# Altium schematic sheet BMS028B_Hardware.SchDoc: Hardware
size 431 x 279 mm; Date: Not shown in title block; ApprovedBy: Not shown in title block; CheckedBy: Not shown in title block; Author: Not shown in title block; CompanyName: Not shown in title block; DrawnBy: M Sunna; Engineer: Not shown in title block; Organization: Not shown in title block; Address1: Not shown in title block; Address2: Not shown in title block; Address3: Not shown in title block; Address4: Not shown in title block; DocumentNumber: 5; Revision: Use project parameter SCH_Rev; SheetNumber: 5; SheetTotal: 5; PageSetup: Record=PageOptions|CenterHorizontal=True|CenterVertical=True|PrintScale=1.00|XCorrection=1.00|YCorrection=1.00|PrintKind=0|BorderSize=5000000|LeftOffset=0|BottomOffset=0|Orientation=2|PaperLength=1000|PaperWidth=1000|Scale=100|PaperSource=15|PrintQuality=600|MediaType=1|DitherType=10|PaperKind=Letter|PrintScaleMode=1; CurrentTime: Not shown in title block; CurrentDate: Not shown in title block; Time: Not shown in title block; DocumentFullPathAndName: Not shown in title block; DocumentName: Not shown in title block; ModifiedDate: Not shown in title block; ImagePath: Not shown in title block
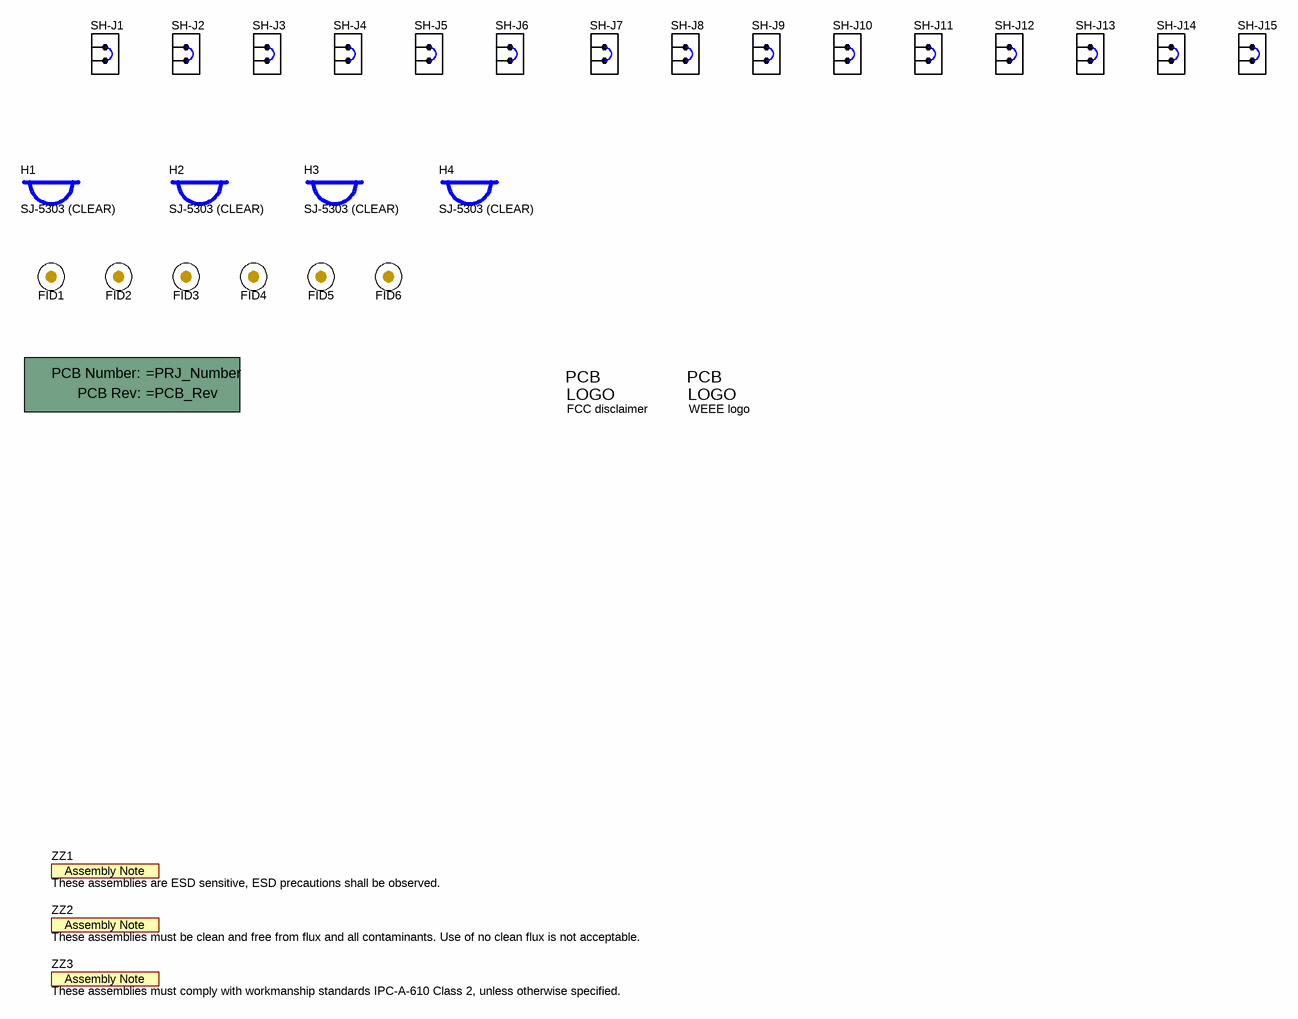
[diagram p0: BMS028B_Hardware.SchDoc]

## Parts
!PCB1  Printed Circuit Board  (value not drawn)  (mechanical)
FID1  Fiducial  [Fiducial10-20]  (value not drawn)
FID2  Fiducial  [Fiducial10-20]  (value not drawn)
FID3  Fiducial  [Fiducial10-20]  (value not drawn)
FID4  Fiducial  [Fiducial10-20]  (value not drawn)
FID5  Fiducial  [Fiducial10-20]  (value not drawn)
FID6  Fiducial  [Fiducial10-20]  (value not drawn)
H1  SJ-5303 (CLEAR)  [Bumpon_SJ5003Transparent]
H2  SJ-5303 (CLEAR)  [Bumpon_SJ5003Transparent]
H3  SJ-5303 (CLEAR)  [Bumpon_SJ5003Transparent]
H4  SJ-5303 (CLEAR)  [Bumpon_SJ5003Transparent]
Logo6  FCC disclaimer  [FCC_disclaimer]  (no BOM)
Logo7  WEEE logo  [WEEE_Minimum]  (no BOM)
SH-J1  SNT-100-BK-G  [SNT-100-BK-G]  (value not drawn)
SH-J2  SNT-100-BK-G  [SNT-100-BK-G]  (value not drawn)
SH-J3  SNT-100-BK-G  [SNT-100-BK-G]  (value not drawn)
SH-J4  SNT-100-BK-G  [SNT-100-BK-G]  (value not drawn)
SH-J5  SNT-100-BK-G  [SNT-100-BK-G]  (value not drawn)
SH-J6  SNT-100-BK-G  [SNT-100-BK-G]  (value not drawn)
SH-J7  SNT-100-BK-G  [SNT-100-BK-G]  (value not drawn)
SH-J8  SNT-100-BK-G  [SNT-100-BK-G]  (value not drawn)
SH-J9  SNT-100-BK-G  [SNT-100-BK-G]  (value not drawn)
SH-J10  SNT-100-BK-G  [SNT-100-BK-G]  (value not drawn)
SH-J11  SNT-100-BK-G  [SNT-100-BK-G]  (value not drawn)
SH-J12  SNT-100-BK-G  [SNT-100-BK-G]  (value not drawn)
SH-J13  SNT-100-BK-G  [SNT-100-BK-G]  (value not drawn)
SH-J14  SNT-100-BK-G  [SNT-100-BK-G]  (value not drawn)
SH-J15  SNT-100-BK-G  [SNT-100-BK-G]  (value not drawn)
ZZ1  These assemblies are ESD sensitive, ESD precautions shall be observed.  [AssemblyNote]  (no BOM)
ZZ2  These assemblies must be clean and free from flux and all contaminants. Use of no clean flux is not acceptable.  [AssemblyNote]  (no BOM)
ZZ3  These assemblies must comply with workmanship standards IPC-A-610 Class 2, unless otherwise specified.  [AssemblyNote]  (no BOM)

## Notes on the sheet
- (in symbol CMP-0003618-2) PCB Number:; PCB Rev:
- (in symbol CMP-0074769-1) PCB; LOGO
- (in symbol CMP-0074847-1) PCB; LOGO

## Library data of the parts
!PCB1 = CMP-0003618-2: Manufacturer: Any; CompType: PCB; PartNumber: =PRJ_Number; RoHS: O; MountType: N/A; Publisher: Texas Instruments; LatestRevisionDate: 2017-03-09; Key: PCB
FID1-FID6 = CMP-0077181-1: Fiducial mark.  There is nothing to buy or mount.; CompType: Fiducial; Manufacturer: N/A; MountType: N/A; PackageReference: N/A; PartNumber: N/A; ClassName: FiducialMark; Library Reference: Fiducial
H1-H4 = CMP-0003620-1: Bumpon, Hemisphere, 0.44 X 0.20, Clear; Manufacturer: 3M; CompType: Bumpon; PartNumber: SJ-5303 (CLEAR); RoHS: Y; PackageReference: Transparent Bumpon; MountType: N/A; ComponentLink1Description: Datasheet Link; ComponentLink1URL: http://multimedia.mmm.com/mws/mediawebserver.dyn?6666660Zjcf6lVs6EVs666cIsCOrrrrQ-; Publisher: Texas Instruments; LatestRevisionDate: 2017-03-09; Supplier 1: Digi-Key; Supplier Part Number 1: SJ5303-7-ND; Supplier 2: Newark; Supplier Part Number 2: 23M7326; Supplier 3: Mouser; Supplier Part Number 3: 517-SJ-5303CL; Key: SJ-5303 (CLEAR)
Logo6 = CMP-0074847-1: FCC_disclaimer; Library Reference: Logo; Published: 2009-03-03; Publisher: Texas Instruments; LatestRevisionDate: 2017-07-06; Lib Reference: FCC_disclaimer; PartNumber: FCC disclaimer
Logo7 = CMP-0074769-1: Library Reference: WEEE logo; Lib Reference: WEEE logo; PartNumber: WEEE logo
SH-J1-SH-J15 = CMP-0003623-3: Shunt, 100mil, Gold plated, Black; Alternate PartNumber: 969102-0000-DA; Manufacturer: Samtec; Alternate Manufacturer: 3M; Value: 1x2; ComponentLink1URL: http://www.samtec.com/ftppub/pdf/SNT.PDF; Supplier 1: Digi-Key; CompType: Shunt; PackageReference: Shunt; ClassName: Shunt; RoHS: Y; Supplier Part Number 1: SAM8858-ND; MountType: N/A; PartNumber: SNT-100-BK-G; ComponentLink1Description: Datasheet Link
ZZ1 = CMP-0077236-1: CompType: AssemblyNote; ClassName: AssemblyNote; Publisher: Texas Instruments; LatestRevisionDate: 2017-08-10; Key: AssemblyNote
ZZ2 = CMP-0077237-1: CompType: AssemblyNote; ClassName: AssemblyNote; Publisher: Texas Instruments; LatestRevisionDate: 2017-08-10; Key: AssemblyNote
ZZ3 = CMP-0077238-1: CompType: AssemblyNote; ClassName: AssemblyNote; Publisher: Texas Instruments; LatestRevisionDate: 2017-08-10; Key: AssemblyNote